# EAGLE schematic clock-kit-board (EAGLE 8.2.2)
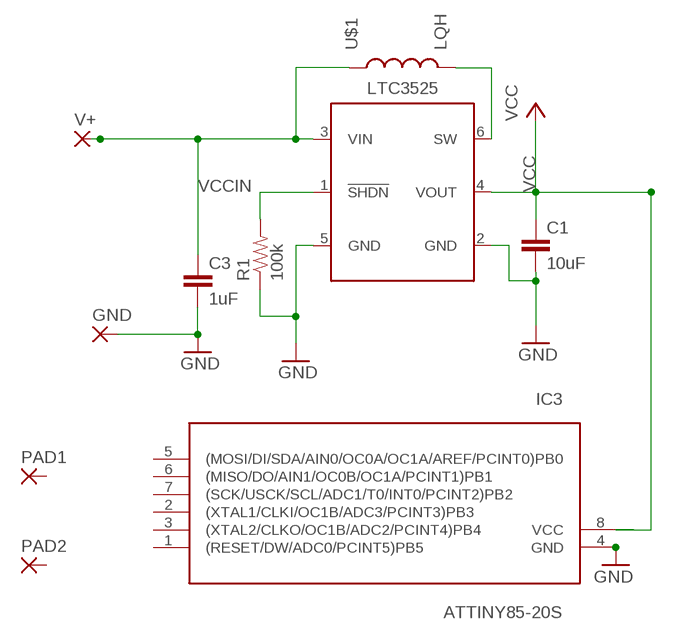
[diagram p0: schematic, sheet 1]

## Parts
C1  10uF  CAP0805  [0805]
C3  1uF  CAP0805  [0805]
GND  SMD5  [SMD2,54-5,08]
IC3  ATTINY85-20S  ATTINY85V-10S  [SOIC8]
PAD1  2,54/1,1  [2,54/1,1]
PAD2  2,54/1,1  [2,54/1,1]
R1  100k  RESISTOR0805-RES  [0805]
U$1  LQH  [LQH32]
U$3  LTC3525  [SC70-6L]
V+  SMD5  [SMD2,54-5,08]

## Nets
GND: C1.2 C3.2 GND.1(P) IC3.4(GND) R1.1 U$3.2(GND) U$3.5(GND)
N$1: U$1.2 U$3.6(SW)
SW: R1.2 U$3.1(!SHDN)
VCC: C1.1 IC3.8(VCC) U$3.4(VOUT)
VCCIN: C3.1 U$1.1 U$3.3(VIN) V+.1(P)
Unconnected: IC3.1((RESET/DW/ADC0/PCINT5)PB5) IC3.2((XTAL1/CLKI/OC1B/ADC3/PCINT3)PB3) IC3.3((XTAL2/CLKO/OC1B/ADC2/PCINT4)PB4) IC3.5((MOSI/DI/SDA/AIN0/OC0A/OC1A/AREF/PCINT0)PB0) IC3.6((MISO/DO/AIN1/OC0B/OC1A/PCINT1)PB1) IC3.7((SCK/USCK/SCL/ADC1/T0/INT0/PCINT2)PB2) PAD1.1(P) PAD2.1(P)

## Library data of the parts
C1 C3 = 0-SparkFun:CAP: Capacitor Standard 0603 ceramic capacitor, and 0.1" leaded capacitor.
GND V+ = wirepad:SMD5: SMD PAD
IC3 = avr:ATTINY85: MICROCONTROLLER 8 Kbytes FLASH 512 bytes EEPROM 512 bytes RAM 4-channel 10 bit ADC USI
PAD1 PAD2 = wirepad:2,54/1,1: THROUGH-HOLE PAD
R1 = 0-SparkFun:RESISTOR: Resistor Basic schematic elements and footprints for 0603, 1206, and PTH resistors.
U$1 = murata-inductor:LQH: Murata LQH32 inductor
U$3 = bicyclelab:LTC3525